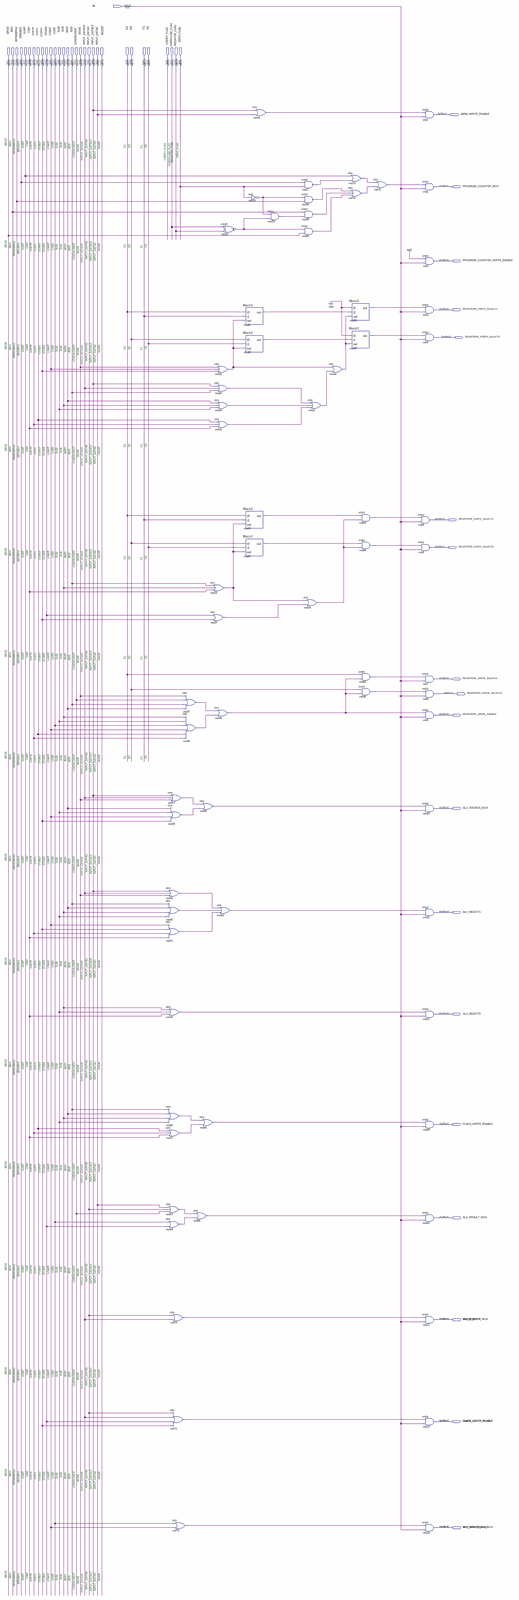
[diagram p0: schematic sheet, whole]
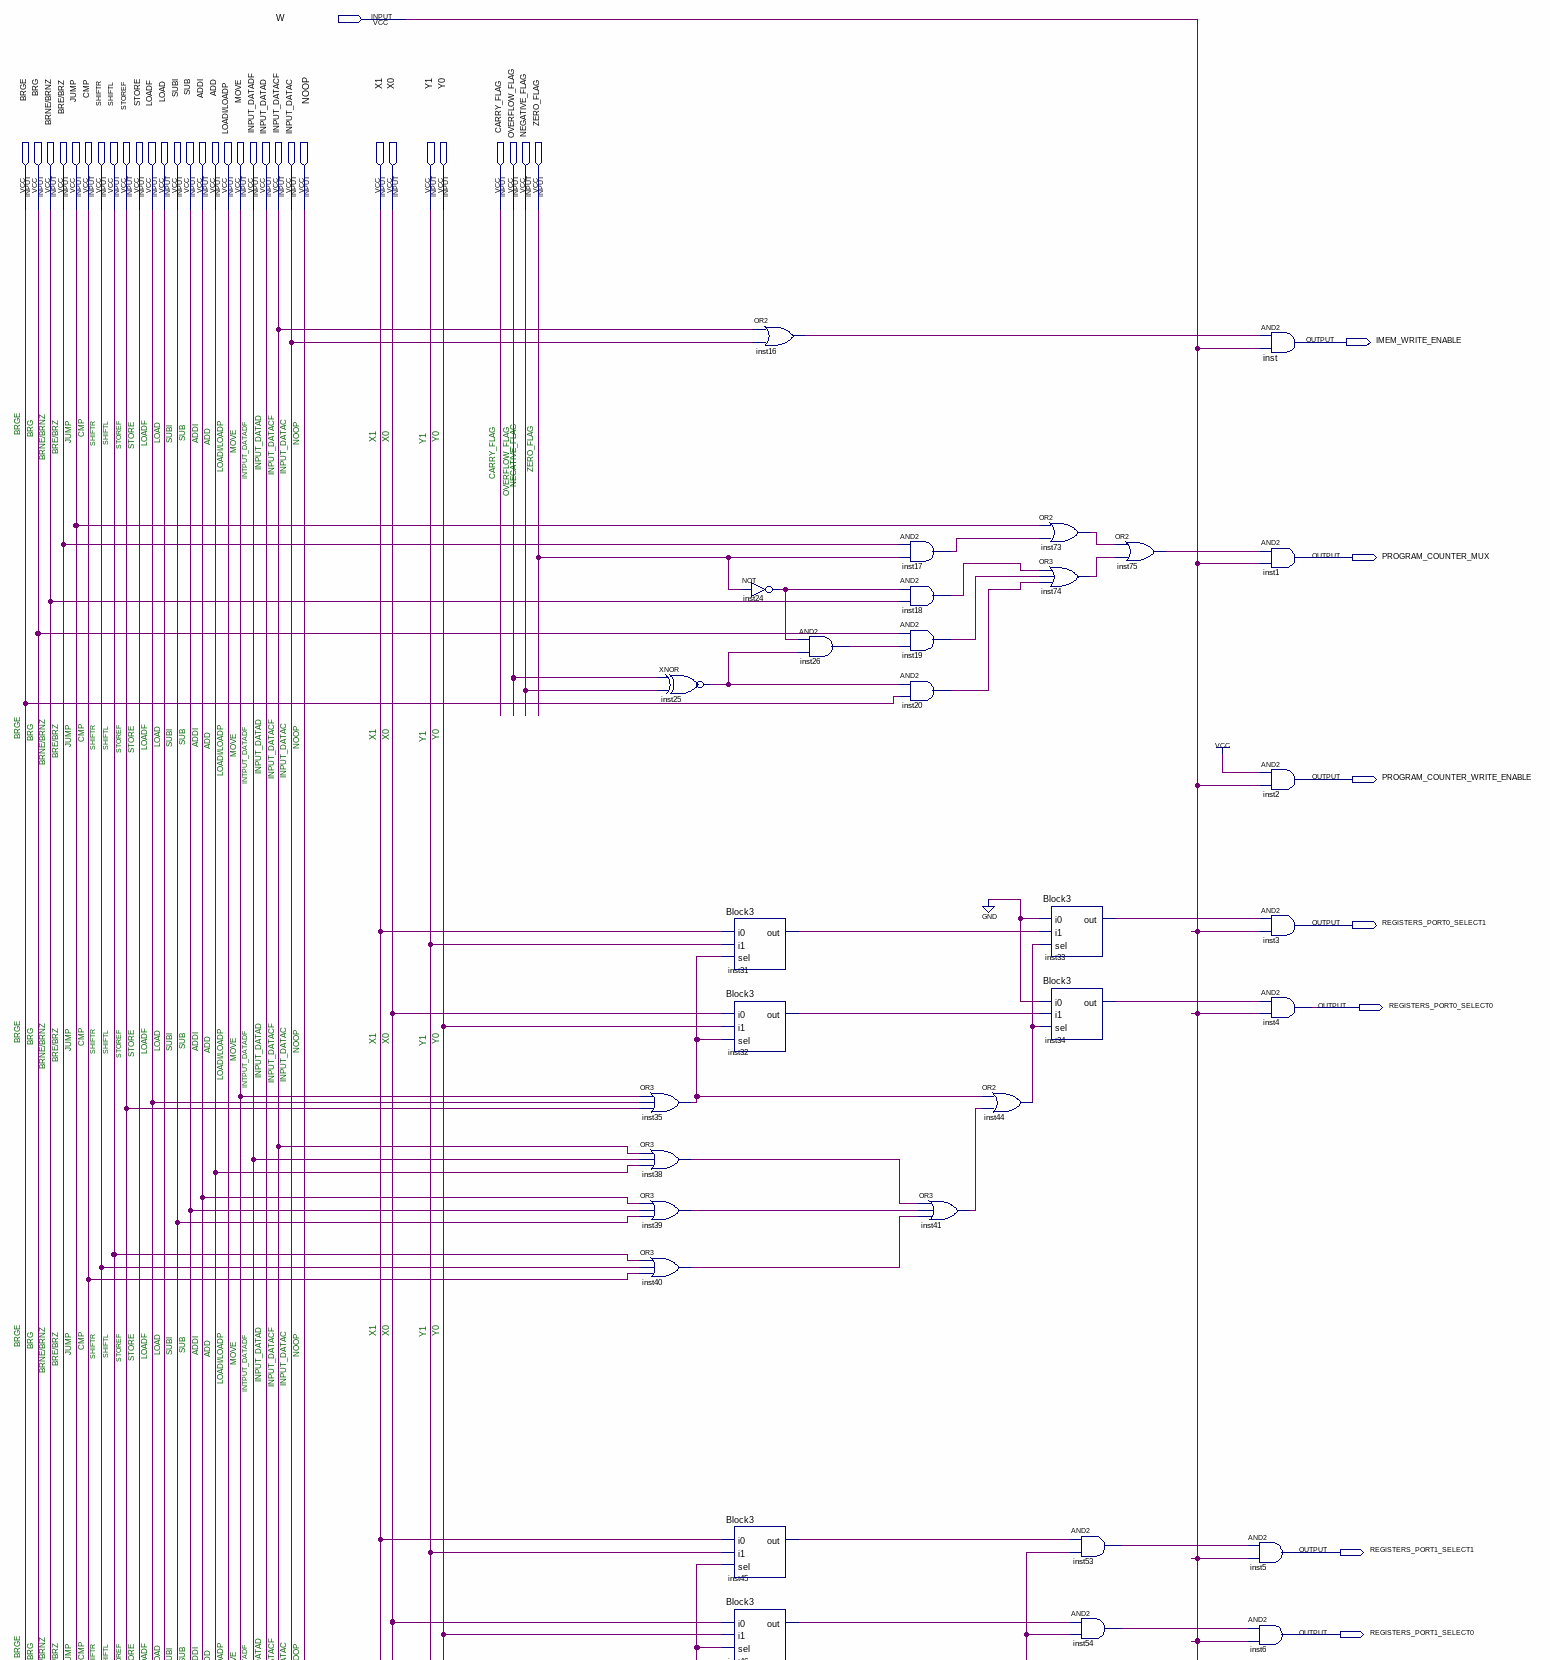
[diagram p1: schematic sheet, upper part]
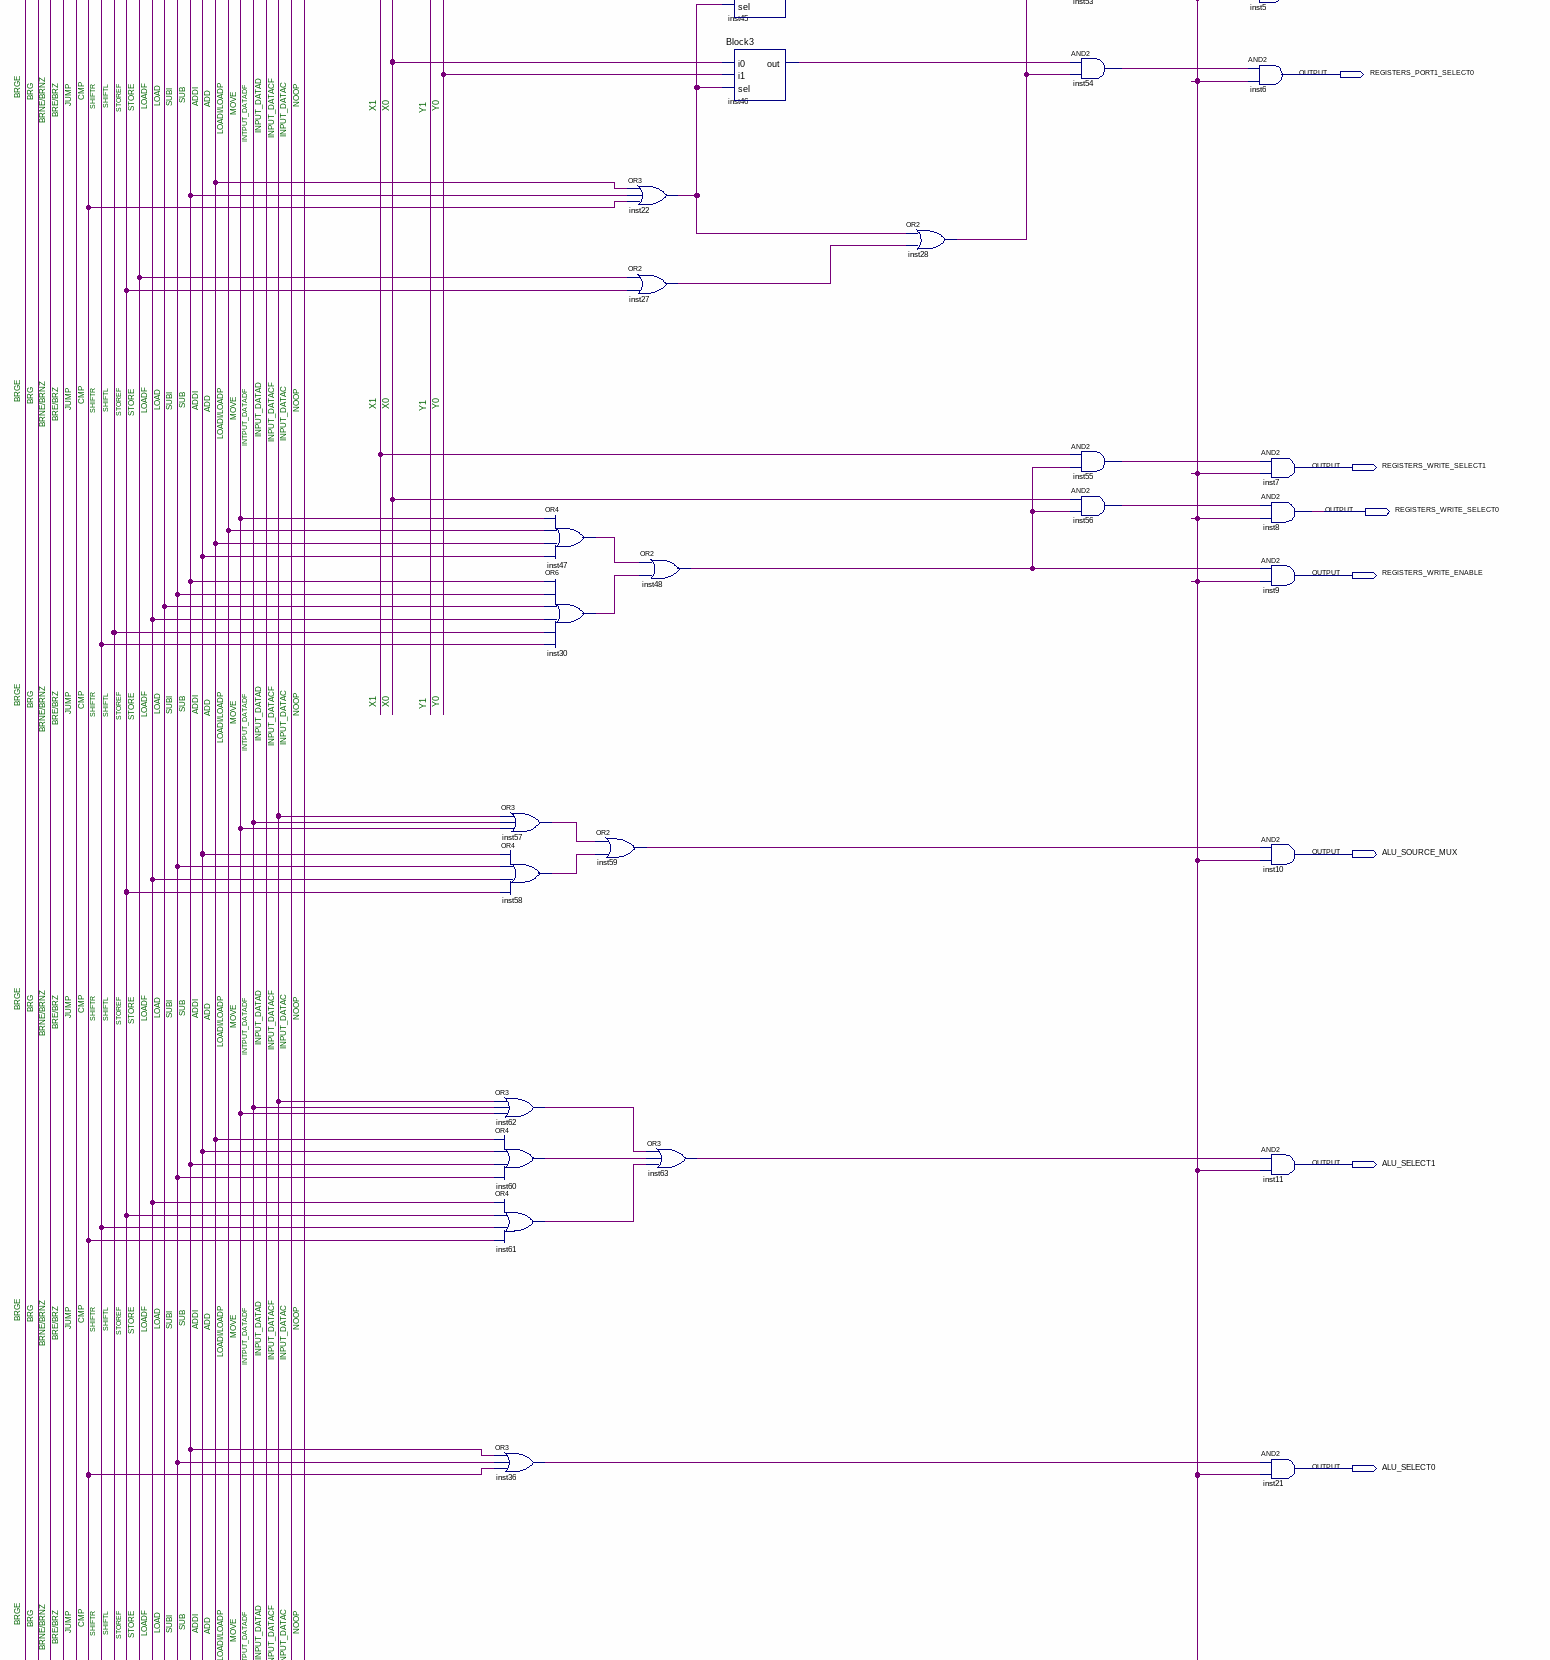
[diagram p2: schematic sheet, middle part]
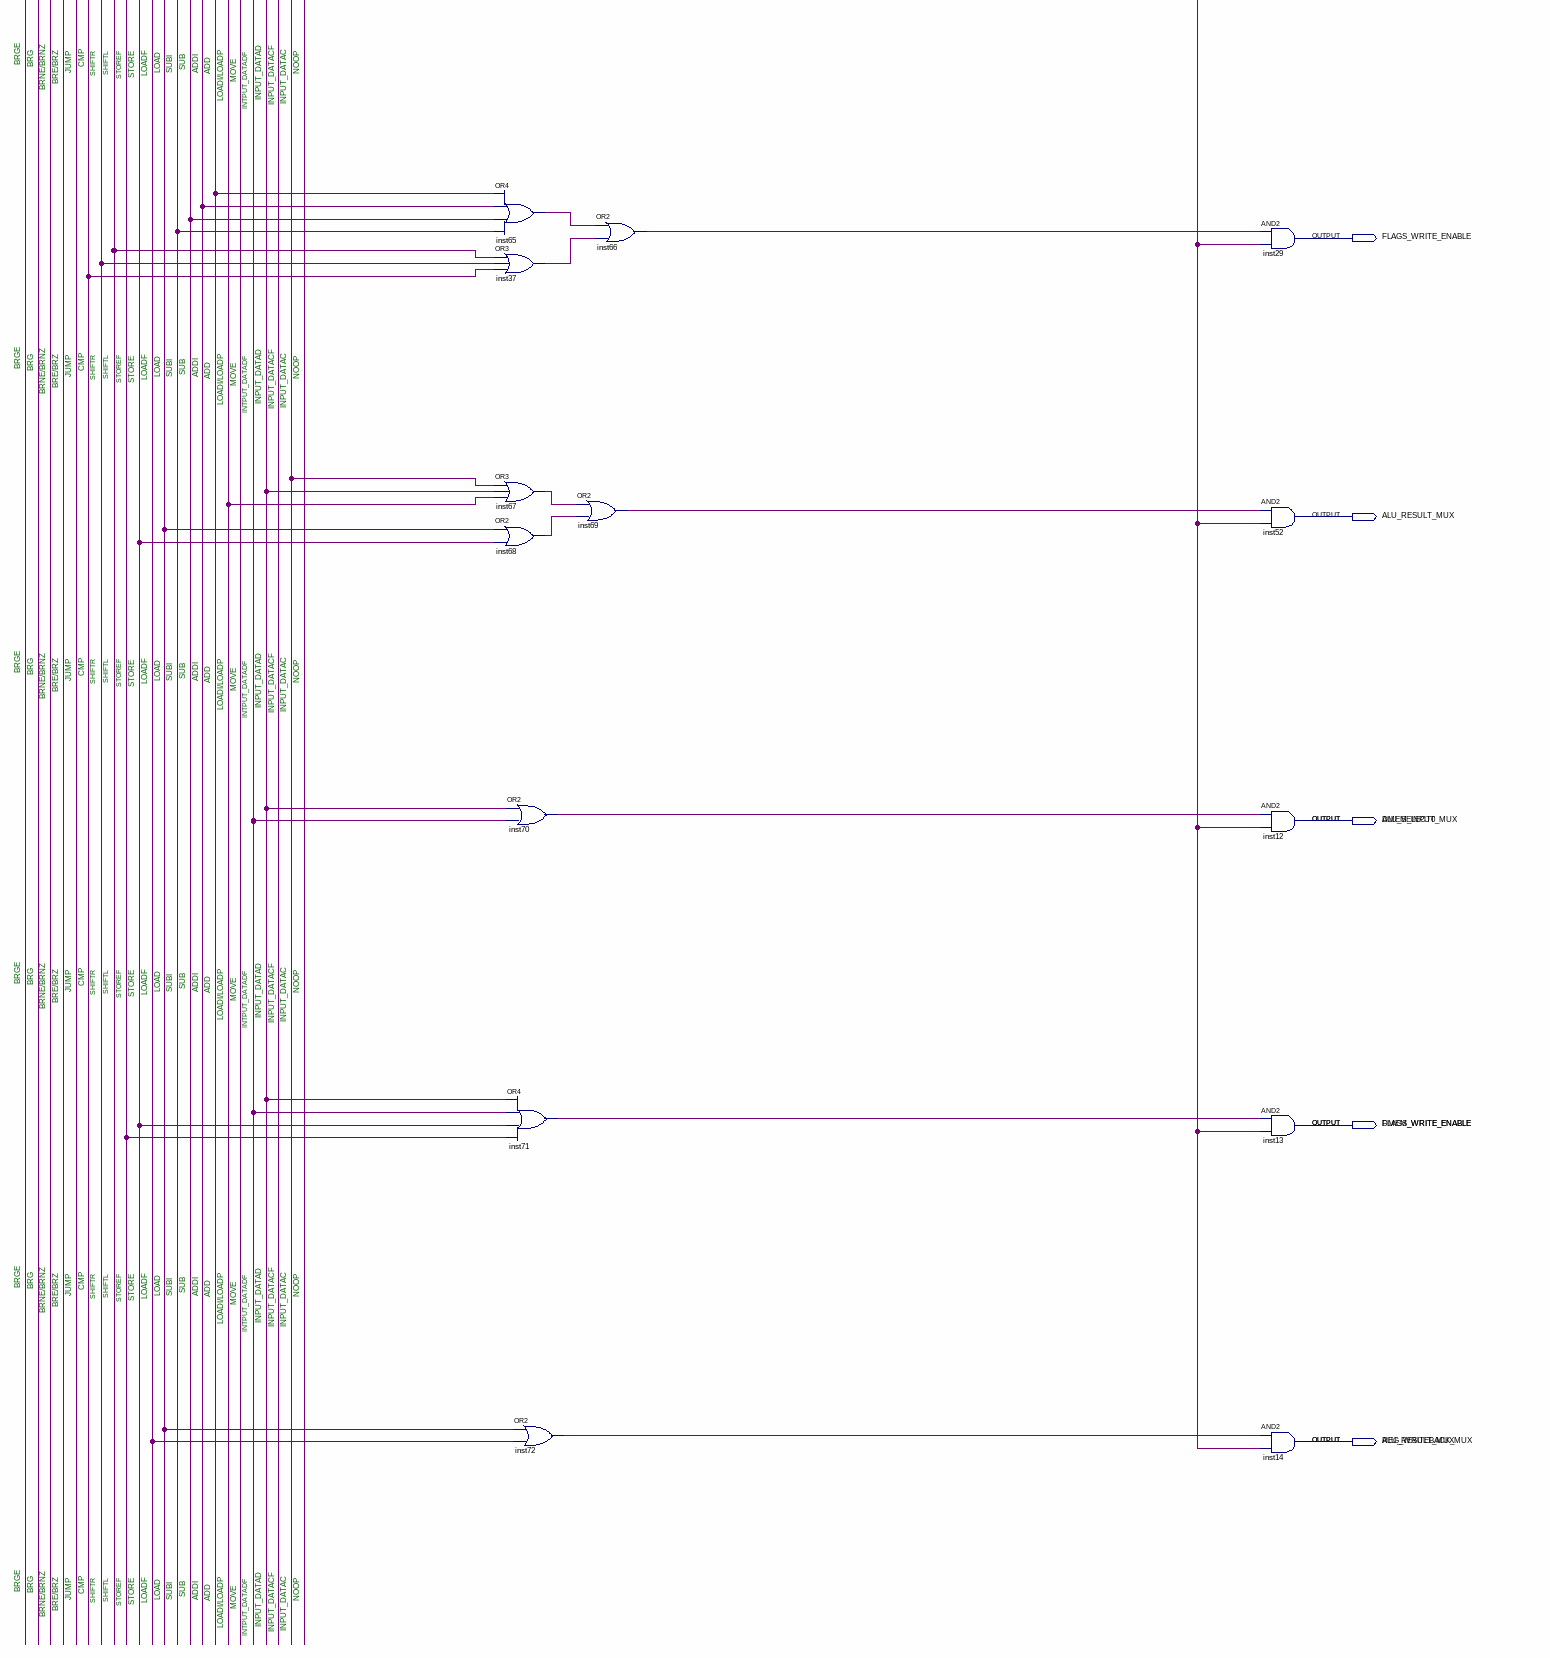
[diagram p3: schematic sheet, lower part]
// Quartus schematic FSM_BDF.bdf as structural Verilog: 68 symbols, 53 pins
module FSM_BDF (
  input  W,
  input  BRGE,
  input  BRG,
  input  \BRNE/BRNZ ,
  input  \BRE/BRZ ,
  input  JUMP,
  input  CMP,
  input  SHIFTR,
  input  SHIFTL,
  input  STOREF,
  input  STORE,
  input  LOADF,
  input  LOAD,
  input  SUBI,
  input  SUB,
  input  ADDI,
  input  ADD,
  input  \LOADI/LOADP ,
  input  MOVE,
  input  INPUT_DATADF,
  input  INPUT_DATAD,
  input  INPUT_DATACF,
  input  INPUT_DATAC,
  input  NOOP,
  input  X1,
  input  X0,
  input  Y1,
  input  Y0,
  input  CARRY_FLAG,
  input  OVERFLOW_FLAG,
  input  NEGATIVE_FLAG,
  input  ZERO_FLAG,
  output IMEM_WRITE_ENABLE,
  output PROGRAM_COUNTER_MUX,
  output PROGRAM_COUNTER_WRITE_ENABLE,
  output REGISTERS_PORT0_SELECT1,
  output REGISTERS_PORT0_SELECT0,
  output REGISTERS_PORT1_SELECT1,
  output REGISTERS_PORT1_SELECT0,
  output REGISTERS_WRITE_SELECT1,
  output REGISTERS_WRITE_SELECT0,
  output REGISTERS_WRITE_ENABLE,
  output ALU_SOURCE_MUX,
  output ALU_SELECT1,
  output ALU_SELECT0,
  output FLAGS_WRITE_ENABLE,
  output ALU_RESULT_MUX,
  output DMEM_INPUT_MUX,
  output DMEM_WRITE_ENABLE,
  output REG_WRITEBACK_MUX
);

  wire inst16_out, inst17_out, inst18_out, inst19_out, inst20_out, inst22_out, inst24_out, inst25_out,
       inst26_out, inst27_out, inst28_out, inst30_out, inst31_out, inst32_out, inst33_out, inst34_out,
       inst35_out, inst36_out, inst37_out, inst38_out, inst39_out, inst40_out, inst41_out, inst44_out,
       inst45_out, inst46_out, inst47_out, inst48_out, inst53_out, inst54_out, inst55_out, inst56_out,
       inst57_out, inst58_out, inst59_out, inst60_out, inst61_out, inst62_out, inst63_out, inst65_out,
       inst66_out, inst67_out, inst68_out, inst69_out, inst70_out, inst71_out, inst72_out, inst73_out,
       inst74_out, inst75_out;

  or inst57 (inst57_out, INPUT_DATACF, INPUT_DATADF, MOVE);
  or inst58 (inst58_out, ADDI, SUBI, LOADF, STOREF);
  or inst62 (inst62_out, INPUT_DATACF, INPUT_DATADF, MOVE);
  or inst60 (inst60_out, ADD, ADDI, SUB, SUBI);
  or inst61 (inst61_out, LOADF, STOREF, SHIFTR, CMP);
  or inst36 (inst36_out, SUB, SUBI, CMP);
  or inst65 (inst65_out, ADD, ADDI, SUB, SUBI);
  or inst37 (inst37_out, SHIFTL, SHIFTR, CMP);
  or inst67 (inst67_out, INPUT_DATAC, INPUT_DATAD, \LOADI/LOADP );
  or inst68 (inst68_out, LOAD, STORE);
  or inst70 (inst70_out, INPUT_DATAD, INPUT_DATADF);
  or inst71 (inst71_out, INPUT_DATAD, INPUT_DATADF, STORE, STOREF);
  or inst72 (inst72_out, LOAD, LOADF);
  or inst47 (inst47_out, MOVE, \LOADI/LOADP , ADD, ADDI);
  or inst30 (inst30_out, SUB, SUBI, LOAD, LOADF, SHIFTL, SHIFTR);
  or inst69 (inst69_out, inst67_out, inst68_out);
  or inst22 (inst22_out, ADD, SUB, CMP);
  or inst27 (inst27_out, STORE, STOREF);
  or inst59 (inst59_out, inst57_out, inst58_out);
  or inst66 (inst66_out, inst65_out, inst37_out);
  xnor inst25 (inst25_out, OVERFLOW_FLAG, NEGATIVE_FLAG);
  or inst35 (inst35_out, MOVE, LOADF, STOREF);
  or inst38 (inst38_out, INPUT_DATACF, INPUT_DATADF, ADD);
  or inst39 (inst39_out, ADDI, SUB, SUBI);
  or inst40 (inst40_out, SHIFTL, SHIFTR, CMP);
  or inst48 (inst48_out, inst47_out, inst30_out);
  or inst63 (inst63_out, inst62_out, inst60_out, inst61_out);
  Block3 inst31 (.i0(X1), .i1(Y1), .sel(inst35_out), .out(inst31_out));
  Block3 inst32 (.i0(X0), .i1(Y0), .sel(inst35_out), .out(inst32_out));
  Block3 inst45 (.i0(X1), .i1(Y1), .sel(inst22_out), .out(inst45_out));
  Block3 inst46 (.i0(X0), .i1(Y0), .sel(inst22_out), .out(inst46_out));
  or inst16 (inst16_out, INPUT_DATACF, INPUT_DATAC);
  not inst24 (inst24_out, ZERO_FLAG);
  and inst26 (inst26_out, inst24_out, inst25_out);
  and inst17 (inst17_out, \BRE/BRZ , ZERO_FLAG);
  and inst18 (inst18_out, inst24_out, \BRNE/BRNZ );
  and inst19 (inst19_out, BRG, inst26_out);
  and inst20 (inst20_out, inst25_out, BRGE);
  or inst41 (inst41_out, inst38_out, inst39_out, inst40_out);
  or inst28 (inst28_out, inst22_out, inst27_out);
  or inst44 (inst44_out, inst35_out, inst41_out);
  or inst73 (inst73_out, JUMP, inst17_out);
  or inst74 (inst74_out, inst18_out, inst19_out, inst20_out);
  Block3 inst33 (.i0(1'b0), .i1(inst31_out), .sel(inst44_out), .out(inst33_out));
  Block3 inst34 (.i0(1'b0), .i1(inst32_out), .sel(inst44_out), .out(inst34_out));
  and inst53 (inst53_out, inst45_out, inst28_out);
  and inst54 (inst54_out, inst46_out, inst28_out);
  and inst55 (inst55_out, X1, inst48_out);
  and inst56 (inst56_out, X0, inst48_out);
  or inst75 (inst75_out, inst73_out, inst74_out);
  and inst (IMEM_WRITE_ENABLE, inst16_out, W);
  and inst1 (PROGRAM_COUNTER_MUX, inst75_out, W);
  and inst2 (PROGRAM_COUNTER_WRITE_ENABLE, 1'b1, W);
  and inst3 (REGISTERS_PORT0_SELECT1, inst33_out, W);
  and inst4 (REGISTERS_PORT0_SELECT0, inst34_out, W);
  and inst5 (REGISTERS_PORT1_SELECT1, inst53_out, W);
  and inst6 (REGISTERS_PORT1_SELECT0, inst54_out, W);
  and inst7 (REGISTERS_WRITE_SELECT1, inst55_out, W);
  and inst8 (REGISTERS_WRITE_SELECT0, inst56_out, W);
  and inst9 (REGISTERS_WRITE_ENABLE, inst48_out, W);
  and inst10 (ALU_SOURCE_MUX, inst59_out, W);
  and inst11 (ALU_SELECT1, inst63_out, W);
  and inst21 (ALU_SELECT0, inst36_out, W);
  and inst29 (DMEM_WRITE_ENABLE, inst66_out, W);
  and inst52 (ALU_RESULT_MUX, inst69_out, W);
  and inst12 (ALU_SELECT0, inst70_out, W);
  and inst13 (DMEM_WRITE_ENABLE, inst71_out, W);
  and inst14 (ALU_RESULT_MUX, inst72_out, W);

  assign DMEM_INPUT_MUX = ALU_SELECT0;
  assign FLAGS_WRITE_ENABLE = DMEM_WRITE_ENABLE;
  assign REG_WRITEBACK_MUX = ALU_RESULT_MUX;

  // Notes on the sheet:
  //   BRGE
  //   BRNE/BRNZ
  //   INTPUT_DATADF
  //   INPUT_DATAD
  //   INPUT_DATACF
  //   LOADI/LOADP
  //   CMP
  //   SHIFTR
  //   SHIFTL
  //   STOREF
  //   LOADF
  //   INPUT_DATAC
  //   BRG
  //   BRE/BRZ
  //   JUMP
  //   LOAD
  //   NOOP
  //   STORE
  //   NEGATIVE_FLAG
  //   SUB
  //   ADDI
  //   OVERFLOW_FLAG
  //   SUBI
  //   ZERO_FLAG
  //   CARRY_FLAG
  //   ADD
  //   MOVE
  //   X1
  //   X0
  //   Y0
  //   Y1
  //   BRGE
  //   BRNE/BRNZ
  //   INTPUT_DATADF
  //   INPUT_DATAD
  //   INPUT_DATACF
  //   LOADI/LOADP
  //   CMP
  //   SHIFTR
  //   SHIFTL
  //   STOREF
  //   LOADF
  //   INPUT_DATAC
  //   BRG
  //   BRE/BRZ
  //   JUMP
  //   LOAD
  //   NOOP
  //   STORE
  //   SUB
  //   ADDI
  //   SUBI
  //   X1
  //   X0
  //   Y0
  //   ADD
  //   Y1
  //   MOVE
  //   BRGE
  //   BRNE/BRNZ
  //   INTPUT_DATADF
  //   INPUT_DATAD
  //   INPUT_DATACF
  //   LOADI/LOADP
  //   CMP
  //   SHIFTR
  //   SHIFTL
  //   STOREF
  //   LOADF
  //   INPUT_DATAC
  //   BRG
  //   BRE/BRZ
  //   JUMP
  //   LOAD
  //   NOOP
  //   STORE
  //   SUB
  //   ADDI
  //   SUBI
  //   X1
  //   X0
  //   Y0
  //   ADD
  //   Y1
  //   MOVE
  //   BRGE
  //   X1
  //   X0
  //   Y0
  //   BRNE/BRNZ
  //   INTPUT_DATADF
  //   INPUT_DATAD
  //   INPUT_DATACF
  //   Y1
  //   LOADI/LOADP
  //   CMP
  //   SHIFTR
  //   SHIFTL
  //   STOREF
  //   LOADF
  //   INPUT_DATAC
  //   BRG
  //   BRE/BRZ
  //   JUMP
  //   LOAD
  //   NOOP
  //   STORE
  //   SUB
  //   ADDI
  //   SUBI
  //   ADD
  //   MOVE
  //   BRGE
  //   BRNE/BRNZ
  //   INTPUT_DATADF
  //   INPUT_DATAD
  //   INPUT_DATACF
  //   LOADI/LOADP
  //   CMP
  //   SHIFTR
  //   SHIFTL
  //   STOREF
  //   LOADF
  //   INPUT_DATAC
  //   BRG
  //   BRE/BRZ
  //   JUMP
  //   LOAD
  //   NOOP
  //   STORE
  //   SUB
  //   ADDI
  //   SUBI
  //   ADD
  //   MOVE
  //   X1
  //   X0
  //   Y0
  //   Y1
  //   BRGE
  //   BRNE/BRNZ
  //   INTPUT_DATADF
  //   INPUT_DATAD
  //   INPUT_DATACF
  //   LOADI/LOADP
  //   CMP
  //   SHIFTR
  //   SHIFTL
  //   STOREF
  //   LOADF
  //   INPUT_DATAC
  //   BRG
  //   BRE/BRZ
  //   JUMP
  //   LOAD
  //   NOOP
  //   STORE
  //   SUB
  //   ADDI
  //   SUBI
  //   ADD
  //   MOVE
  //   X1
  //   X0
  //   Y0
  //   Y1
  //   BRGE
  //   BRNE/BRNZ
  //   INTPUT_DATADF
  //   INPUT_DATAD
  //   INPUT_DATACF
  //   LOADI/LOADP
  //   CMP
  //   SHIFTR
  //   SHIFTL
  //   STOREF
  //   LOADF
  //   INPUT_DATAC
  //   BRG
  //   BRE/BRZ
  //   JUMP
  //   LOAD
  //   NOOP
  //   STORE
  //   SUB
  //   ADDI
  //   SUBI
  //   X1
  //   X0
  //   Y0
  //   ADD
  //   Y1
  //   MOVE
  //   BRGE
  //   BRNE/BRNZ
  //   INTPUT_DATADF
  //   INPUT_DATAD
  //   INPUT_DATACF
  //   LOADI/LOADP
  //   CMP
  //   SHIFTR
  //   SHIFTL
  //   STOREF
  //   LOADF
  //   INPUT_DATAC
  //   BRG
  //   BRE/BRZ
  //   JUMP
  //   LOAD
  //   NOOP
  //   STORE
  //   SUB
  //   ADDI
  //   SUBI
  //   ADD
  //   MOVE
  //   BRGE
  //   BRNE/BRNZ
  //   INTPUT_DATADF
  //   INPUT_DATAD
  //   INPUT_DATACF
  //   LOADI/LOADP
  //   CMP
  //   SHIFTR
  //   SHIFTL
  //   STOREF
  //   LOADF
  //   INPUT_DATAC
  //   BRG
  //   BRE/BRZ
  //   JUMP
  //   LOAD
  //   NOOP
  //   STORE
  //   SUB
  //   ADDI
  //   SUBI
  //   ADD
  //   MOVE
  //   BRGE
  //   BRNE/BRNZ
  //   INTPUT_DATADF
  //   INPUT_DATAD
  //   INPUT_DATACF
  //   LOADI/LOADP
  //   CMP
  //   SHIFTR
  //   SHIFTL
  //   STOREF
  //   LOADF
  //   INPUT_DATAC
  //   BRG
  //   BRE/BRZ
  //   JUMP
  //   LOAD
  //   NOOP
  //   STORE
  //   SUB
  //   ADDI
  //   SUBI
  //   ADD
  //   MOVE
  //   BRGE
  //   BRNE/BRNZ
  //   INTPUT_DATADF
  //   INPUT_DATAD
  //   INPUT_DATACF
  //   LOADI/LOADP
  //   CMP
  //   SHIFTR
  //   SHIFTL
  //   STOREF
  //   LOADF
  //   INPUT_DATAC
  //   BRG
  //   BRE/BRZ
  //   JUMP
  //   LOAD
  //   NOOP
  //   STORE
  //   SUB
  //   ADDI
  //   SUBI
  //   ADD
  //   MOVE
  //   BRGE
  //   BRNE/BRNZ
  //   INTPUT_DATADF
  //   INPUT_DATAD
  //   INPUT_DATACF
  //   LOADI/LOADP
  //   CMP
  //   SHIFTR
  //   SHIFTL
  //   STOREF
  //   LOADF
  //   INPUT_DATAC
  //   BRG
  //   BRE/BRZ
  //   JUMP
  //   LOAD
  //   NOOP
  //   STORE
  //   SUB
  //   ADDI
  //   SUBI
  //   ADD
  //   MOVE
  //   BRGE
  //   BRNE/BRNZ
  //   INTPUT_DATADF
  //   INPUT_DATAD
  //   INPUT_DATACF
  //   LOADI/LOADP
  //   CMP
  //   SHIFTR
  //   SHIFTL
  //   STOREF
  //   LOADF
  //   INPUT_DATAC
  //   BRG
  //   BRE/BRZ
  //   JUMP
  //   LOAD
  //   NOOP
  //   STORE
  //   SUB
  //   ADDI
  //   SUBI
  //   ADD
  //   MOVE
  //   BRGE
  //   BRNE/BRNZ
  //   INTPUT_DATADF
  //   INPUT_DATAD
  //   INPUT_DATACF
  //   LOADI/LOADP
  //   CMP
  //   SHIFTR
  //   SHIFTL
  //   STOREF
  //   LOADF
  //   INPUT_DATAC
  //   BRG
  //   BRE/BRZ
  //   JUMP
  //   LOAD
  //   NOOP
  //   STORE
  //   SUB
  //   ADDI
  //   SUBI
  //   ADD
  //   MOVE
  //   BRGE
  //   BRNE/BRNZ
  //   INTPUT_DATADF
  //   INPUT_DATAD
  //   INPUT_DATACF
  //   LOADI/LOADP
  //   CMP
  //   SHIFTR
  //   SHIFTL
  //   STOREF
  //   LOADF
  //   INPUT_DATAC
  //   BRG
  //   BRE/BRZ
  //   JUMP
  //   LOAD
  //   NOOP
  //   STORE
  //   SUB
  //   ADDI
  //   SUBI
  //   ADD
  //   MOVE
endmodule
